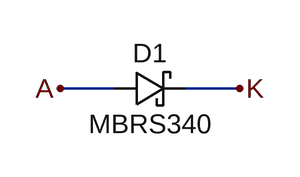
[diagram p0: schematic My_zenner.asc]
My_zenner.asc, the LTspice schematic file:
Version 4
SHEET 1 1056 712
WIRE -64 160 -112 160
WIRE 48 160 0 160
FLAG 48 160 K
FLAG -112 160 A
SYMBOL schottky -64 176 R270
WINDOW 0 32 32 VTop 2
WINDOW 3 0 32 VBottom 2
SYMATTR InstName D1
SYMATTR Value MBRS340
SYMATTR Description Diode
SYMATTR Type diode

The netlist it stands for:
* My_zenner.asc
D1 A K MBRS340
.model D D
.lib standard.dio
.backanno
.end